# Altium schematic sheet TempSense.SchDoc
size A; DrawnBy: Levi Balling; Engineer: Levi Balling; DocumentNumber: 1; Revision: -; SheetNumber: 1; SheetTotal: 1; DocumentName: Temperature Sensor; ModifiedDate: 3/2/2012; ProjectName: Smart House
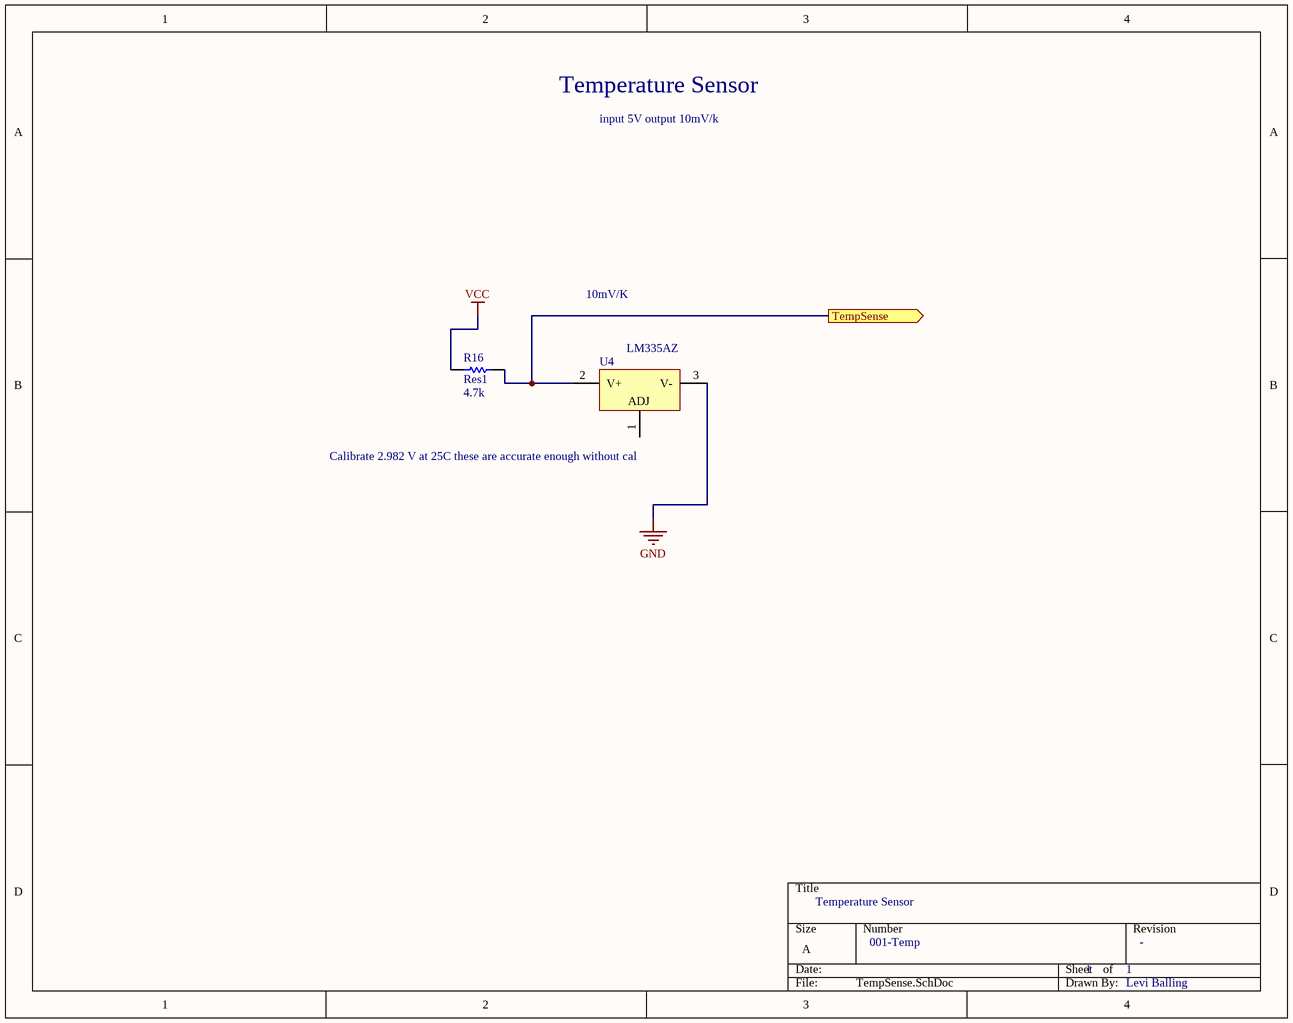
[diagram p0: TempSense.SchDoc]

## Parts
R16  Res1  value 4.7k  [AXIAL-0.3]
U4  LM335AZ  [Z03A]

## Ports
TempSense (out)

## Nets
GND: U4.3(V-)
VCC: R16.1
TempSense: R16.2 U4.2(V+) ; port TempSense

Not connected (* = marked no-connect by the designer): U4 1(ADJ)

## Notes on the sheet
- Temperature Sensor
- input 5V output 10mV/k
- 10mV/K
- (near U4) Calibrate 2.982 V at 25C these are accurate enough without cal
- 001-Temp
- 1
- -
- Levi Balling

## Library data of the parts
R16 = Res1: Resistor; Published: 8-Jun-2000; LatestRevisionDate: 17-Jul-2002; LatestRevisionNote: Re-released for DXP Platform.; PackageReference: AXIAL-0.3; Publisher: Altium Limited; PackageDescription: Axial Device, Thru-Hole; 2 Leads; 0.3 in Pin Spacing
U4 = LM335AZ: Precision Temperature Sensor; Manufacturer: National Semiconductor; CompType: Temp Sensor IC; PackageTopMarking: NSXYTT*LM335*AZ; PowerWise: N; Published: 29-May-2009; DatasheetVersion: Dec-2008; PackageVersion: revG, Sep-2000; PackageReference: Z03A; Publisher: Altium Limited; PackageDescription: TO-92, Molded, 3 Lead; PartNumber: LM335AZ; RoHS: O; PinCount: 3; DigiKeyPartNumber: LM335AZ-ND; Code_JEDEC: TO-226-AA; ComponentLink1Description: LM335A Datasheet; ComponentLink1URL: http://www.national.com/ds/LM/LM335.pdf; ComponentLink2Description: LM335A Web Page; ComponentLink2URL: http://www.national.com/pf/LM/LM335A.html; ComponentLink3Description: Z03A Package Page; ComponentLink3URL: http://www.national.com/packaging/folders/z03a.html